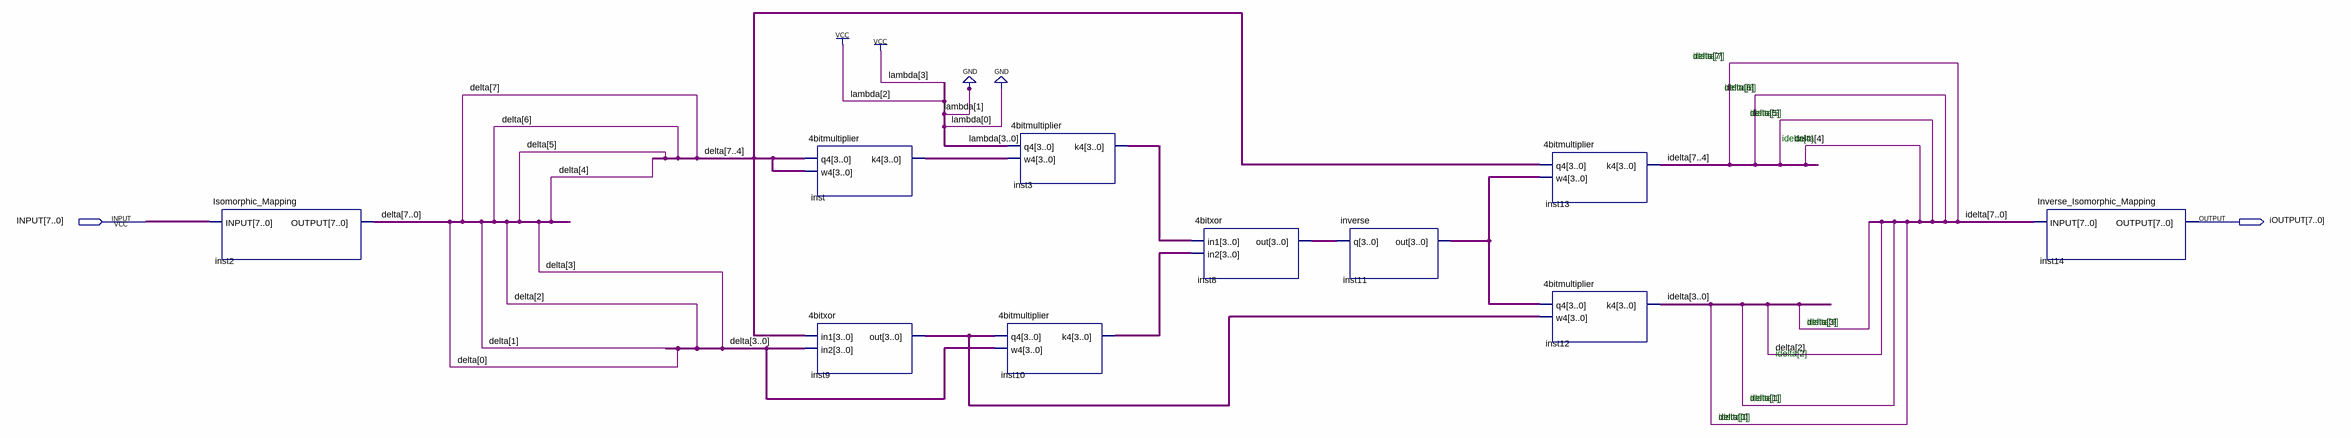
[diagram p0: schematic sheet]
// Quartus schematic MultiplicativeInversion.bdf as structural Verilog: 10 symbols, 2 pins
module MultiplicativeInversion (
  input  [7:0] INPUT,
  output [7:0] iOUTPUT
);

  wire [3:0] inst3_k4, inst8_out, inst9_out, inst10_k4, inst11_out, inst_k4;
  wire [7:0] delta, idelta;

  Isomorphic_Mapping inst2 (.INPUT(INPUT), .OUTPUT(delta));
  \4bitmultiplier  inst (.q4(delta[7:4]), .w4(delta[7:4]), .k4(inst_k4));
  \4bitxor  inst9 (.in1(delta[7:4]), .in2(delta[3:0]), .out(inst9_out));
  \4bitmultiplier  inst10 (.q4(inst9_out), .w4(delta[3:0]), .k4(inst10_k4));
  \4bitmultiplier  inst3 (.q4(4'b1100), .w4(inst_k4), .k4(inst3_k4));
  \4bitxor  inst8 (.in1(inst3_k4), .in2(inst10_k4), .out(inst8_out));
  inverse inst11 (.q(inst8_out), .out(inst11_out));
  \4bitmultiplier  inst13 (.q4(delta[7:4]), .w4(inst11_out), .k4(idelta[7:4]));
  \4bitmultiplier  inst12 (.q4(inst11_out), .w4(inst9_out), .k4(idelta[3:0]));
  Inverse_Isomorphic_Mapping inst14 (.INPUT(idelta), .OUTPUT(iOUTPUT));

  // Notes on the sheet:
  //   idelta[7]
  //   idelta[6]
  //   idelta[5]
  //   idelta[4]
  //   idelta[3]
  //   idelta[2]
  //   idelta[1]
  //   idelta[0]
endmodule
